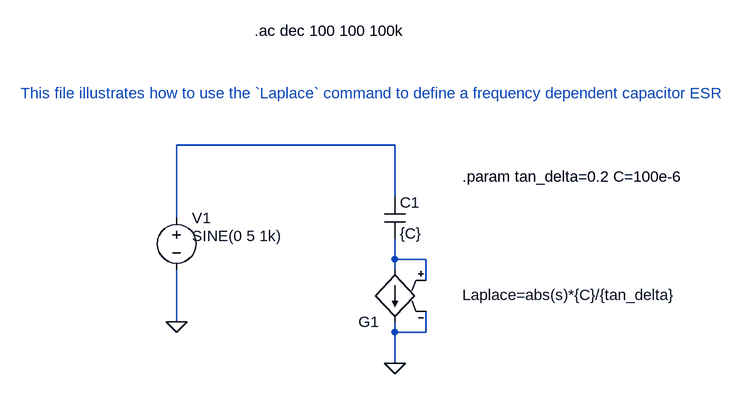
[diagram p0: schematic _freq_dependent_capacitor.asc]
_freq_dependent_capacitor.asc, the LTspice schematic file:
Version 4
SHEET 1 1212 680
WIRE 464 0 128 0
WIRE 464 80 464 0
WIRE 128 112 128 0
WIRE 464 176 464 144
WIRE 512 176 464 176
WIRE 464 192 464 176
WIRE 512 208 512 176
WIRE 128 272 128 192
WIRE 464 288 464 272
WIRE 512 288 512 256
WIRE 512 288 464 288
WIRE 464 336 464 288
FLAG 128 272 0
FLAG 464 336 0
SYMBOL voltage 128 96 R0
WINDOW 3 24 44 Left 2
WINDOW 39 0 0 Left 0
SYMATTR InstName V1
SYMATTR Value SINE(0 5 1k)
SYMATTR Value2 AC 1 0
SYMBOL cap 448 80 R0
SYMATTR InstName C1
SYMATTR Value {C}
SYMATTR SpiceLine Rser=0
SYMBOL g2 464 288 R180
WINDOW 3 -436 57 Left 2
SYMATTR InstName G1
SYMATTR Value Laplace=abs(s)*{C}/{tan_delta}
TEXT 248 -176 Left 2 !.ac dec 100 100 100k
TEXT 568 48 Left 2 !.param tan_delta=0.2 C=100e-6
TEXT -112 -80 Left 2 ;This file illustrates how to use the `Laplace` command to define a frequency dependent capacitor ESR

The netlist it stands for:
* _freq_dependent_capacitor.asc
V1 N001 0 SINE(0 5 1k) AC 1 0
C1 N001 N002 {C} Rser=0
G1 N002 0 N002 0 Laplace=abs(s)*{C}/{tan_delta}
.ac dec 100 100 100k
.param tan_delta=0.2 C=100e-6
* This file illustrates how to use the `Laplace` command to define a frequency dependent capacitor ESR
.backanno
.end